# EAGLE design M452r (EAGLE 6.6.0)
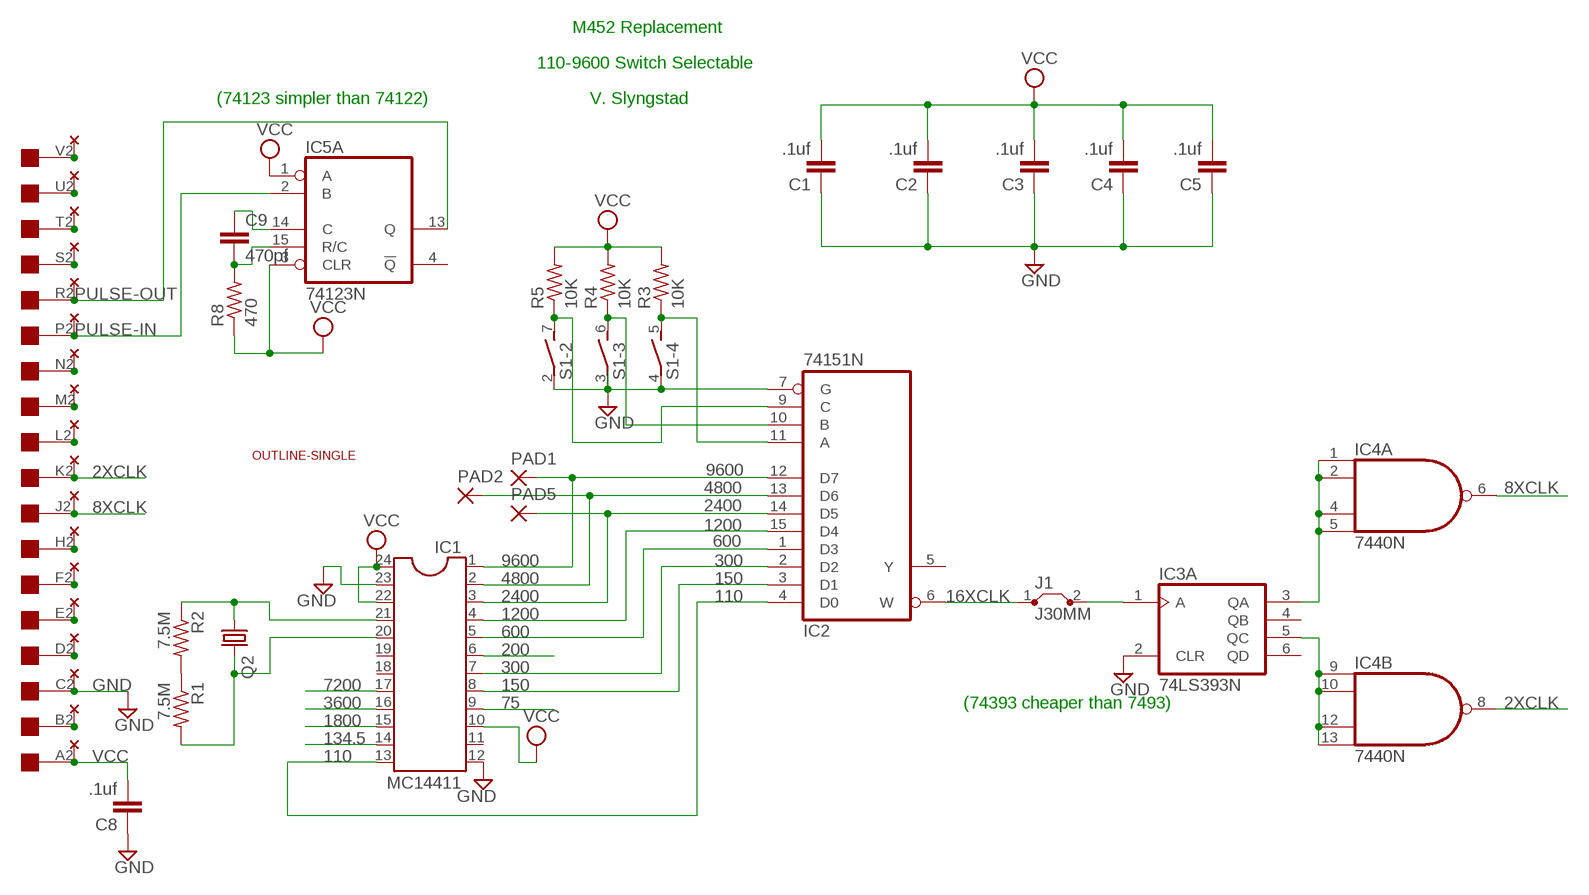
[diagram p0: schematic, sheet 1]

## Parts
C1  .1uf  C-EU050-025X075  [C050-025X075]
C2  .1uf  C-EU050-025X075  [C050-025X075]
C3  .1uf  C-EU050-025X075  [C050-025X075]
C4  .1uf  C-EU050-025X075  [C050-025X075]
C5  .1uf  C-EU050-025X075  [C050-025X075]
C8  .1uf  C-EU050-025X075  [C050-025X075]
C9  470pf  C-EU050-025X075  [C050-025X075]
IC1  MC14411  DIL24-6  [DIL24-6]
IC2  74151N  [DIL16]
IC3  74LS393N  [DIL14]
IC4  7440N  74S20N  [DIL14]
IC5  74123N  [DIL16]
J1  J30MM  [30]
PAD1  1,6/0,8  [1,6/0,8]
PAD2  1,6/0,8  [1,6/0,8]
PAD5  1,6/0,8  [1,6/0,8]
Q2  CRYSTALHC49U-H  [HC49U-H]
R1  7.5M  R-US_0204/7  [0204/7]
R2  7.5M  R-US_0204/7  [0204/7]
R3  10K  R-US_0204/7  [0204/7]
R4  10K  R-US_0204/7  [0204/7]
R5  10K  R-US_0204/7  [0204/7]
R8  470  R-US_0204/7  [0204/7]
S1  DIP04S  [DIP04S]
U$2  EDGE-1  [EDGE-CON1]
U$3  THRU-HOLE1  [THRU-HOLE1]
U$4  OUTLINE-SINGLE  [SINGLE]

## Nets
2XCLK: IC4.8(B:O) U$2.K2 U$3.K2
8XCLK: IC4.6(A:O) U$2.J2 U$3.J2
16XCLK: IC2.6(W) J1.1
75: IC1.9
110: IC1.13 IC2.4(D0)
134.5: IC1.14
150: IC1.8 IC2.3(D1)
200: IC1.6
300: IC1.7 IC2.2(D2)
600: IC1.5 IC2.1(D3)
1200: IC1.4 IC2.15(D4)
1800: IC1.15
2400: IC1.3 IC2.14(D5) PAD5.1(P)
3600: IC1.16
4800: IC1.2 IC2.13(D6) PAD2.1(P)
7200: IC1.17
9600: IC1.1 IC2.12(D7) PAD1.1(P)
GND: C1.1 C2.1 C3.1 C4.1 C5.1 C8.1 IC1.12 IC1.23 IC2.7(G) IC3.2(A:CLR) S1.2 S1.3 S1.4 U$2.C2 U$3.C2
N$1: IC1.20 Q2.2 R1.2
N$2: IC2.9(C) R5.1 S1.7
N$3: R1.1 R2.2
N$4: IC3.1(A:A) J1.2
N$5: U$2.V2 U$3.V2
N$6: U$2.U2 U$3.U2
N$7: U$2.T2 U$3.T2
N$8: U$2.S2 U$3.S2
N$9: U$2.N2 U$3.N2
N$10: IC3.5(A:QC) IC4.9(B:I0) IC4.10(B:I1) IC4.12(B:I2) IC4.13(B:I3)
N$11: U$2.M2 U$3.M2
N$12: IC3.3(A:QA) IC4.1(A:I0) IC4.2(A:I1) IC4.4(A:I2) IC4.5(A:I3)
N$13: U$2.L2 U$3.L2
N$14: U$2.H2 U$3.H2
N$15: U$2.F2 U$3.F2
N$16: U$2.E2 U$3.E2
N$17: IC2.11(A) R3.1 S1.5
N$18: IC1.21 Q2.1 R2.1
N$19: U$2.D2 U$3.D2
N$20: IC2.10(B) R4.1 S1.6
N$21: C9.2 IC5.15(A:R/C) R8.2
N$22: C9.1 IC5.14(A:C)
N$23: U$2.B2 U$3.B2
PULSE-IN: IC5.2(A:B) U$2.P2 U$3.P2
PULSE-OUT: IC5.13(A:Q) U$2.R2 U$3.R2
VCC: C1.2 C2.2 C3.2 C4.2 C5.2 C8.2 IC1.10 IC1.22 IC1.24 IC5.1(A:A) IC5.3(A:CLR) R3.2 R4.2 R5.2 R8.1 U$2.A2 U$3.A2
Unconnected: IC1.11 IC1.18 IC1.19 IC2.5(Y) IC3.4(A:QB) IC3.6(A:QD) IC3.8(B:QD) IC3.9(B:QC) IC3.10(B:QB) IC3.11(B:QA) IC3.12(B:CLR) IC3.13(B:A) IC5.4(A:!Q) IC5.5(B:Q) IC5.6(B:C) IC5.7(B:R/C) IC5.9(B:A) IC5.10(B:B) IC5.11(B:CLR) IC5.12(B:!Q) S1.1 S1.8

## Notes on the sheet
- M452 Replacement
- 110-9600 Switch Selectable
- (74123 simpler than 74122) | V. Slyngstad
- (74393 cheaper than 7493)

## Power pins joined to a net without a drawn wire
GND: IC2.8(GND) IC3.7(P:GND) IC4.7(P:GND) IC5.8(P:GND)
VCC: IC2.16(VCC) IC3.14(P:VCC) IC4.14(P:VCC) IC5.16(P:VCC)

## Library data of the parts
C1-C5 C8 C9 = rcl:C-EU: CAPACITOR, European symbol
IC1 = ic-package:DIL24: Dual In Line
IC2 = 74xx-us:74*151: Data SELECTOR/MULTIPLEXER
IC3 = 74xx-us:74*393: Dual 4-bit decade and binary COUNTER
IC4 = 74xx-us:74*20: Dual 4-input NAND gate
IC5 = 74xx-us:74*123: Retriggerable monostable MULTIVIBRATOR
J1 = jumper:J: Bridge
PAD1 PAD2 PAD5 = wirepad:1,6/0,8: THROUGH-HOLE PAD
Q2 = crystal:CRYSTAL: CRYSTAL; OC_FARNELL: 1666973; OC_NEWARK: unknown
R1-R5 R8 = rcl:R-US_: RESISTOR, American symbol
S1 = switch-dil:DIP04S: DIL/CODE SWITCH; OC_FARNELL: unknown; OC_NEWARK: unknown
U$2 = dec-con:EDGE-1: Single-Sided DEC Edge Connector -- (side 2)
U$3 = dec-con:THRU-HOLE1: Thru-Hole addition to double-sided edge connector.
U$4 = dec-con:OUTLINE-*: Board outlines for DEC boards.

## Board
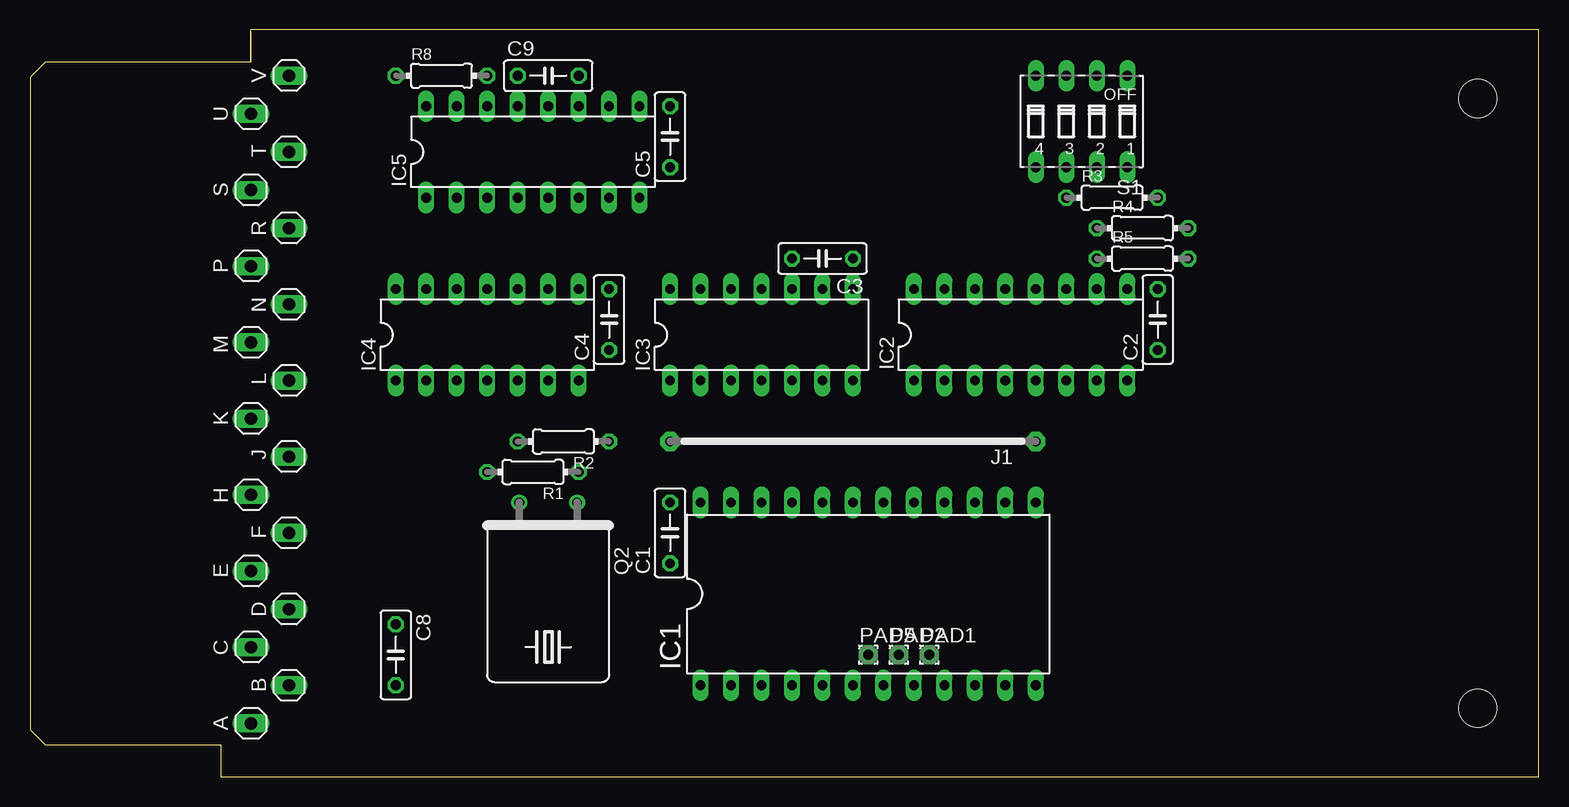
[diagram p1: board, top side]
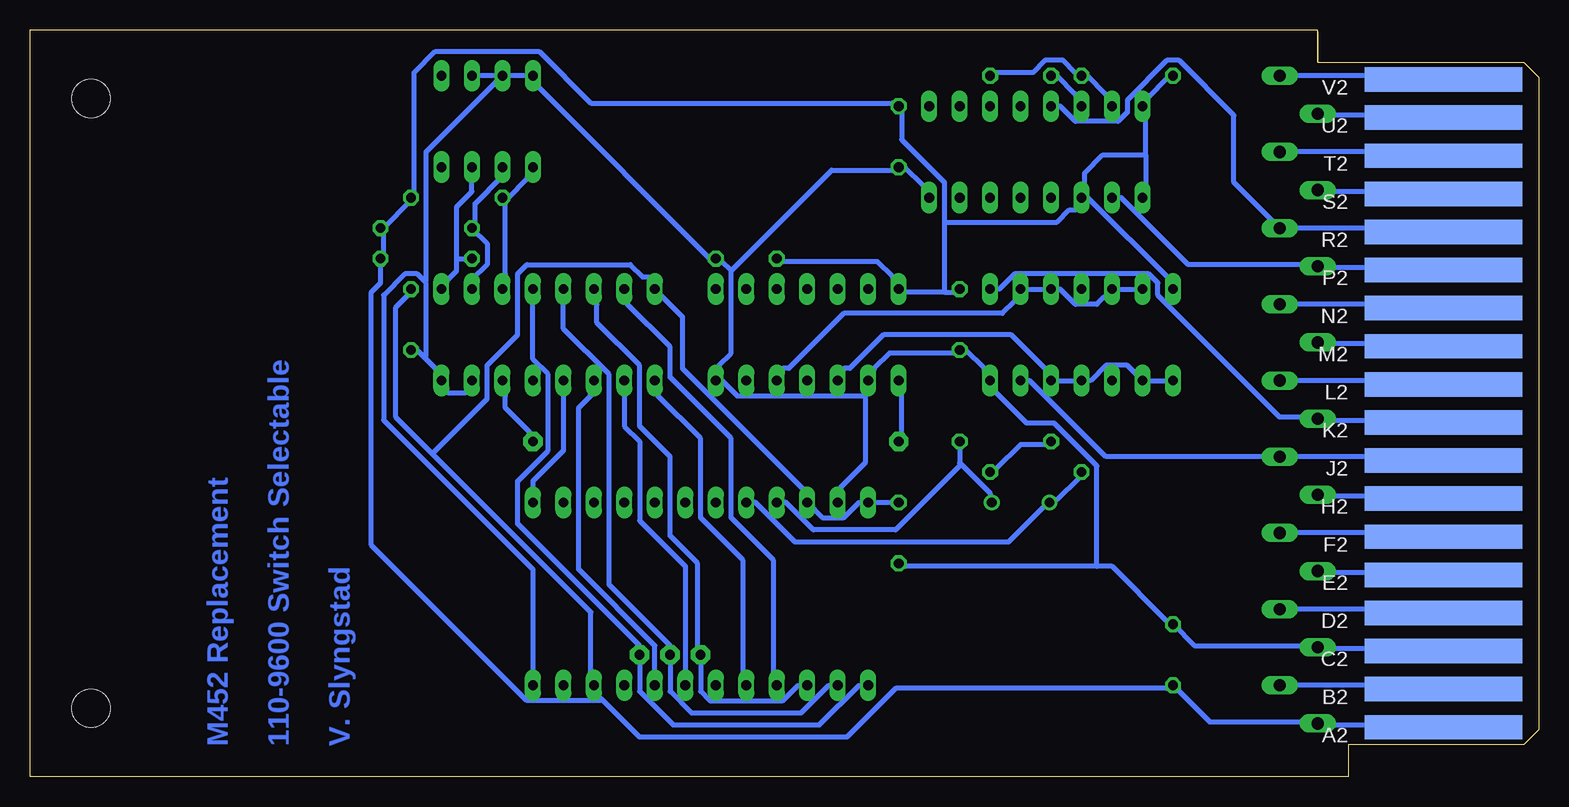
[diagram p2: board, bottom side, seen from below]

Size 125.73 x 62.23 mm. Coordinates in mm from the lower left corner, seen from the top.
Copper layers (1+16): Top 0.035mm / dielectric 1.5mm / Bottom 0.035mm
Design rules "16mils": minimum track width 16mil, minimum drill 32mil, track to track 15mil, track to pad 10mil, pad to pad 10mil, via to via 10mil, smd to smd 10mil, copper to edge 13mil, drill to drill 10mil, minimum pad ring 10mil, minimum via ring 8mil, stop-mask expansion 0mil, vias tented up to drill 0mil, thermal gap 10mil

### Footprints (pad centres in the part's own frame; a part is rotated, then mirrored left to right if it is on the bottom)
C050-025X075 = drill 0.813 octagon: 1 -2.54,0; 2 2.54,0
DIL24-6 = drill 0.813 long: 1 -13.97,-7.62; 2 -11.43,-7.62; 3 -8.89,-7.62; 4 -6.35,-7.62; 5 -3.81,-7.62; 6 -1.27,-7.62; 7 1.27,-7.62; 8 3.81,-7.62; 9 6.35,-7.62; 10 8.89,-7.62; 11 11.43,-7.62; 12 13.97,-7.62; 13 13.97,7.62; 14 11.43,7.62; 15 8.89,7.62; 16 6.35,7.62; 17 3.81,7.62; 18 1.27,7.62; 19 -1.27,7.62; 20 -3.81,7.62; 21 -6.35,7.62; 22 -8.89,7.62; 23 -11.43,7.62; 24 -13.97,7.62
DIL16 = drill 0.813 long: 1 -8.89,-3.81; 2 -6.35,-3.81; 3 -3.81,-3.81; 4 -1.27,-3.81; 5 1.27,-3.81; 6 3.81,-3.81; 7 6.35,-3.81; 8 8.89,-3.81; 9 8.89,3.81; 10 6.35,3.81; 11 3.81,3.81; 12 1.27,3.81; 13 -1.27,3.81; 14 -3.81,3.81; 15 -6.35,3.81; 16 -8.89,3.81
DIL14 = drill 0.813 long: 1 -7.62,-3.81; 2 -5.08,-3.81; 3 -2.54,-3.81; 4 0,-3.81; 5 2.54,-3.81; 6 5.08,-3.81; 7 7.62,-3.81; 8 7.62,3.81; 9 5.08,3.81; 10 2.54,3.81; 11 0,3.81; 12 -2.54,3.81; 13 -5.08,3.81; 14 -7.62,3.81
30 = drill 0.813 pad 1.6 octagon: 1 -15.24,0; 2 15.24,0
1,6/0,8 = drill 0.813 pad 1.6 octagon: 1 0,0
HC49U-H = drill 0.813: 1 -2.413,-5.08; 2 2.413,-5.08
0204/7 = drill 0.813 octagon: 1 -3.81,0; 2 3.81,0
DIP04S = drill 0.813 long: 1 -3.81,-3.81; 2 -1.27,-3.81; 3 1.27,-3.81; 4 3.81,-3.81; 5 3.81,3.81; 6 1.27,3.81; 7 -1.27,3.81; 8 -3.81,3.81
EDGE-CON1 = smd 13.106 x 2.032 bottom: A2 7.938,4.128; B2 7.938,7.303; C2 7.938,10.477; D2 7.938,13.652; E2 7.938,16.828; F2 7.938,20.003; H2 7.938,23.177; J2 7.938,26.352; K2 7.938,29.527; L2 7.938,32.703; M2 7.938,35.877; N2 7.938,39.053; P2 7.938,42.227; R2 7.938,45.403; S2 7.938,48.578; T2 7.938,51.752; U2 7.938,54.928; V2 7.938,58.102
THRU-HOLE1 = drill 1.016 long: A2 28.575,3.175; B2 25.4,6.35; C2 22.225,3.175; D2 19.05,6.35; E2 15.875,3.175; F2 12.7,6.35; H2 9.525,3.175; J2 6.35,6.35; K2 3.175,3.175; L2 0,6.35; M2 -3.175,3.175; N2 -6.35,6.35; P2 -9.525,3.175; R2 -12.7,6.35; S2 -15.875,3.175; T2 -19.05,6.35; U2 -22.225,3.175; V2 -25.4,6.35
SINGLE = hole 3.175: 120.65,56.515; 120.65,5.715

### Placement (x,y rotation side)
C1  53.34,20.32 90 top
C2  93.98,38.1 90 top
C3  66.04,43.18 180 top
C4  48.26,38.1 90 top
C5  53.34,53.34 90 top
C8  30.48,10.16 270 top
C9  43.18,58.42 0 top
IC1  69.85,15.24 0 top
IC2  82.55,36.83 0 top
IC3  60.96,36.83 0 top
IC4  38.1,36.83 0 top
IC5  41.91,52.07 0 top
J1  68.58,27.94 180 top
PAD1  74.93,10.16 0 top
PAD2  72.39,10.16 0 top
PAD5  69.85,10.16 0 top
Q2  43.18,17.78 180 top
R1  41.91,25.4 180 top
R2  44.45,27.94 180 top
R3  90.17,48.26 0 top
R4  92.71,45.72 0 top
R5  92.71,43.18 0 top
R8  34.29,58.42 0 top
S1  87.63,54.61 180 top
U$2  0,0 0 top
U$3  15.24,33.02 270 top
U$4  0,0 0 top

### Tracks (layer width: path | path; a pad name or v marks a point on that pad's centre or on a via)
2XCLK
  Bottom 0.406: IC4.8 44.96,40.64 43.69,41.91 32.51,41.91 31.75,41.15 31.75,40.13 21.59,29.97 18.54,29.97 U$3.K2 18.29,29.72 8.13,29.72 U$2.K2
8XCLK
  Bottom 0.406: U$2.J2 8.13,26.42 8.38,26.67 U$3.J2 36.07,26.67 42.42,33.02 IC4.6
16XCLK
  Bottom 0.406: IC2.6 86.11,31.75 86.11,30.73 84.07,28.7 J1.1
110
  Bottom 0.406: IC1.13 83.82,24.64 81.28,27.18 IC2.4
150
  Bottom 0.406: IC1.8 73.66,10.92 80.01,17.27 80.01,30.73 78.99,31.75 IC2.3
300
  Bottom 0.406: IC1.7 71.12,17.53 74.93,21.34 74.93,27.94 76.2,29.21 IC2.2
600
  Bottom 0.406: IC1.5 66.29,8.89 66.29,18.03 69.85,21.59 69.85,28.19 73.41,31.75 IC2.1
1200
  Bottom 0.406: IC1.4 63.75,8.89 63.75,18.03 67.31,21.59 67.31,28.19 72.39,33.27 72.39,35.81 75.95,39.37 IC2.15
2400
  Bottom 0.406: IC2.14 78.49,39.37 78.49,37.85 74.93,34.29 74.93,29.21 72.39,26.67 72.39,20.07 70.1,17.78 70.1,10.92 PAD5.1 69.85,7.11 69.09,6.35 62.99,6.35 61.72,7.62 IC1.3
4800
  Bottom 0.406: IC1.2 59.18,7.62 61.47,5.33 70.61,5.33 72.39,7.11 PAD2.1 72.39,10.92 77.47,16 77.47,33.53 81.28,37.34 IC2.13
9600
  Bottom 0.406: IC1.1 56.64,7.62 59.94,4.32 72.14,4.32 74.93,7.11 PAD1.1 74.93,10.92 85.09,21.08 85.09,24.64 82.55,27.18 82.55,33.53 83.82,34.8 IC2.12
GND
  Bottom 0.406: IC2.7 89.41,32 90.93,32 IC2.8 91.95,34.04 92.84,34.92 | 92.84,34.92 93.47,35.56 C2.1 | 36.83,17.53 35.56,17.53 30.99,12.95 C8.1 28.7,10.92 18.54,10.92 U$3.C2 18.29,10.67 8.13,10.67 U$2.C2 | 36.83,17.53 52.83,17.53 C1.1 | IC5.8 51.31,49.28 52.83,50.8 C5.1 53.85,50.55 58.93,50.55 67.31,42.16 | 56.13,31.75 56.13,26.16 58.17,24.13 IC1.23 | 56.13,31.75 IC3.2 55.37,34.04 54.1,35.31 48.77,35.31 C4.1 47.75,35.56 46.23,34.04 IC4.7 45.21,32 42.67,29.46 40.39,29.46 36.83,25.91 36.83,17.53 | 67.31,42.16 68.07,42.93 C3.1 69.09,43.18 83.31,57.4 S1.4 S1.3 | 67.31,42.16 67.31,35.31 68.33,34.29 IC3.7 68.33,33.27 66.8,31.75 56.13,31.75 | S1.3 S1.2 | IC1.12 83.82,17.27 96.27,29.72 96.27,40.13 94.49,41.91 93.47,41.91 92.84,41.27 | 92.84,41.27 92.71,41.15 92.71,35.05 92.84,34.92 | S1.3 92.71,52.07 92.71,41.4 92.84,41.27
N$1
  Bottom 0.406: R1.2 38.35,24.89 40.13,23.11 Q2.2 40.89,22.86 44.2,19.56 61.98,19.56 65.28,22.86 IC1.20
N$2
  Bottom 0.406: S1.7 88.9,48.77 90.17,47.5 90.17,43.18 | 90.17,43.18 90.17,42.16 91.44,40.89 IC2.9 | 90.17,43.18 R5.1
N$3
  Bottom 0.406: R2.2 41.15,27.69 43.18,27.69 45.21,25.65 R1.1
N$4
  Bottom 0.406: IC3.1 53.09,31.75 53.09,28.7 J1.2
N$5
  Bottom 0.406: U$3.V2 8.38,58.42 8.13,58.17 U$2.V2
N$6
  Bottom 0.406: 18.54,55.37 U$3.U2 18.29,55.12 8.13,55.12 U$2.U2
N$7
  Bottom 0.406: U$3.T2 8.38,52.07 8.13,51.82 U$2.T2
N$8
  Bottom 0.406: 18.54,49.02 U$3.S2 18.29,48.77 8.13,48.77 U$2.S2
N$9
  Bottom 0.406: U$3.N2 8.38,39.37 8.13,39.12 U$2.N2
N$10
  Bottom 0.406: IC3.5 62.99,34.04 62.48,34.04 57.91,38.61 44.7,38.61 43.69,39.62 IC4.9 IC4.10 39.88,40.64 38.61,39.37 36.83,39.37 IC4.12 IC4.13
N$11
  Bottom 0.406: 18.54,36.32 U$3.M2 18.29,36.07 8.13,36.07 U$2.M2
N$12
  Bottom 0.406: IC3.3 57.91,34.04 57.4,34.04 54.61,36.83 43.94,36.83 41.15,34.04 IC4.5 IC4.4 37.34,33.02 36.07,34.29 34.29,34.29 IC4.2 IC4.1
N$13
  Bottom 0.406: U$3.L2 8.38,33.02 8.13,32.77 U$2.L2
N$14
  Bottom 0.406: 18.54,23.62 U$3.H2 18.29,23.37 8.13,23.37 U$2.H2
N$15
  Bottom 0.406: U$3.F2 8.38,20.32 8.13,20.07 U$2.F2
N$16
  Bottom 0.406: 18.54,17.27 U$3.E2 18.29,17.02 8.13,17.02 U$2.E2
N$17
  Bottom 0.406: IC2.11 86.11,41.91 86.11,47.75 R3.1 85.85,48.26 84.33,49.78 S1.5
N$18
  Bottom 0.406: 48.13,26.04 48.26,26.16 R2.1 | 48.13,26.04 45.72,23.62 45.72,22.86 Q2.1 | IC1.21 62.74,22.86 60.45,20.57 53.59,20.57 48.13,26.04
N$19
  Bottom 0.406: U$3.D2 8.38,13.97 8.13,13.72 U$2.D2
N$20
  Bottom 0.406: IC2.10 88.9,41.4 87.63,42.67 87.63,44.45 R4.1 88.65,45.72 88.65,47.75 86.36,50.04 S1.6
N$21
  Bottom 0.406: IC5.15 36.07,56.9 37.59,58.42 R8.2 38.61,58.67 39.62,59.69 41.15,59.69 42.16,58.67 45.21,58.67 C9.2
N$22
  Bottom 0.406: IC5.14 38.61,56.9 40.13,58.42 C9.1
N$23
  Bottom 0.406: U$3.B2 8.38,7.62 8.13,7.37 U$2.B2
PULSE-IN
  Bottom 0.406: IC5.2 34.8,48.26 29.21,42.67 18.54,42.67 U$3.P2 18.29,42.42 8.13,42.42 U$2.P2
PULSE-OUT
  Bottom 0.406: U$2.R2 8.13,45.47 8.38,45.72 U$3.R2 25.4,49.53 25.4,55.12 29.97,59.69 30.99,59.69 34.29,56.39 34.29,55.37 35.05,54.61 38.61,54.61 39.88,55.88 IC5.13
VCC
  Bottom 0.406: 32.77,51.82 32.77,54.61 IC5.16 32.51,56.64 30.99,58.17 R8.1 | 32.77,51.82 32.77,49.53 IC5.1 | 32.77,51.82 36.32,51.82 37.85,50.29 37.85,49.53 IC5.3 | 49.53,40.39 52.83,40.39 IC3.14 53.85,41.66 55.12,42.93 62.99,42.93 C3.2 | 49.53,40.39 48.77,40.39 C4.2 | 49.53,46.23 49.53,40.39 | 49.53,46.23 49.53,49.53 53.09,53.09 53.09,55.37 C5.2 53.85,56.13 78.99,56.13 83.31,60.45 91.95,60.45 93.73,58.67 93.73,48.77 R3.2 94.23,47.75 96.01,45.97 R4.2 96.27,45.21 96.27,43.69 R5.2 96.52,41.15 97.28,40.39 97.28,19.3 84.33,6.35 78.23,6.35 78.11,6.48 | 49.53,46.23 40.13,46.23 39.12,47.24 38.61,47.24 IC5.3 | 92.2,26.92 95.25,29.97 95.25,39.12 94.23,40.13 C2.2 | 92.2,26.92 78.99,13.72 78.99,8.89 IC1.10 78.23,6.6 78.11,6.48 | 78.11,6.48 74.93,3.3 57.66,3.3 53.59,7.37 30.99,7.37 C8.2 27.43,4.57 18.54,4.57 U$3.A2 18.29,4.32 8.13,4.32 U$2.A2 | 92.2,26.92 87.63,31.5 87.63,34.29 85.09,36.83 85.09,41.91 84.33,42.67 75.69,42.67 74.68,41.66 74.17,41.66 IC2.16 71.37,38.35 71.37,34.04 60.96,23.62 IC1.22 59.69,21.59 57.91,21.59 56.64,22.86 IC1.24 C1.2 | IC4.14 30.48,41.15 37.85,48.51 IC5.3

### Text on the board
Bottom: V. Slyngstad | 110-9600 Switch Selectable | M452 Replacement